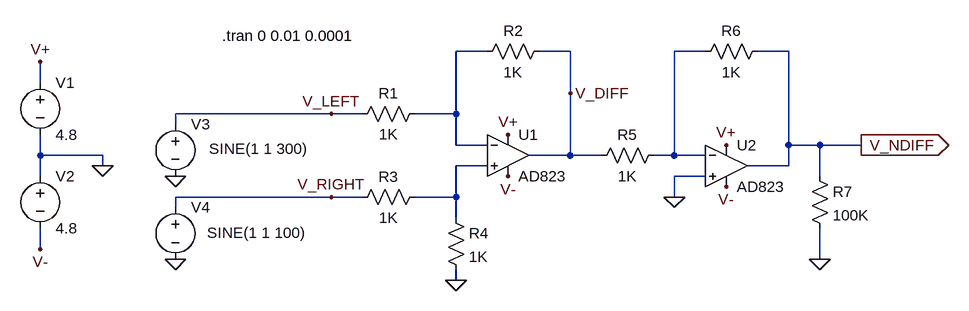
[diagram p0: schematic subtracter.asc]
subtracter.asc, the LTspice schematic file:
Version 4
SHEET 1 880 680
WIRE 16 96 -32 96
WIRE 144 96 96 96
WIRE 352 96 304 96
WIRE 480 96 432 96
WIRE -672 144 -672 112
WIRE 144 160 144 96
WIRE -224 192 -464 192
WIRE -176 192 -224 192
WIRE -32 192 -32 96
WIRE -32 192 -96 192
WIRE -464 208 -464 192
WIRE -32 240 -32 192
WIRE 16 240 -32 240
WIRE 480 240 480 96
WIRE 528 240 480 240
WIRE 592 240 528 240
WIRE -672 256 -672 224
WIRE -576 256 -672 256
WIRE 144 256 144 160
WIRE 144 256 80 256
WIRE 192 256 144 256
WIRE 304 256 304 96
WIRE 304 256 272 256
WIRE 352 256 304 256
WIRE -576 272 -576 256
WIRE 16 272 -32 272
WIRE 480 272 480 240
WIRE 480 272 416 272
WIRE -672 288 -672 256
WIRE 352 288 304 288
WIRE 528 288 528 240
WIRE -224 320 -464 320
WIRE -176 320 -224 320
WIRE -32 320 -32 272
WIRE -32 320 -96 320
WIRE 304 320 304 288
WIRE -464 336 -464 320
WIRE -32 352 -32 320
WIRE -672 400 -672 368
WIRE 528 416 528 368
WIRE -32 448 -32 432
FLAG -576 272 0
FLAG -672 112 V+
FLAG 48 224 V+
FLAG -672 400 V-
FLAG 48 288 V-
FLAG 592 240 V_NDIFF
IOPIN 592 240 Out
FLAG -32 448 0
FLAG 384 240 V+
FLAG 384 304 V-
FLAG -464 288 0
FLAG -464 416 0
FLAG 304 320 0
FLAG 528 416 0
FLAG -224 192 V_LEFT
FLAG -224 320 V_RIGHT
FLAG 144 160 V_DIFF
SYMBOL res -80 176 R90
WINDOW 0 0 56 VBottom 2
WINDOW 3 32 56 VTop 2
SYMATTR InstName R1
SYMATTR Value 1K
SYMATTR SpiceLine tol=1 pwr=0.1
SYMBOL res 112 80 R90
WINDOW 0 0 56 VBottom 2
WINDOW 3 32 56 VTop 2
SYMATTR InstName R2
SYMATTR Value 1K
SYMBOL res -80 304 R90
WINDOW 0 0 56 VBottom 2
WINDOW 3 32 56 VTop 2
SYMATTR InstName R3
SYMATTR Value 1K
SYMBOL voltage -672 128 R0
WINDOW 123 0 0 Left 0
WINDOW 39 0 0 Left 0
SYMATTR InstName V1
SYMATTR Value 4.8
SYMBOL voltage -672 272 R0
WINDOW 123 0 0 Left 0
WINDOW 39 0 0 Left 0
SYMATTR InstName V2
SYMATTR Value 4.8
SYMBOL Opamps\\AD823 48 192 R0
SYMATTR InstName U1
SYMBOL res -48 336 R0
SYMATTR InstName R4
SYMATTR Value 1K
SYMBOL Opamps\\AD823 384 208 R0
SYMATTR InstName U2
SYMBOL res 288 240 R90
WINDOW 0 0 56 VBottom 2
WINDOW 3 32 56 VTop 2
SYMATTR InstName R5
SYMATTR Value 1K
SYMBOL res 448 80 R90
WINDOW 0 0 56 VBottom 2
WINDOW 3 32 56 VTop 2
SYMATTR InstName R6
SYMATTR Value 1K
SYMBOL voltage -464 192 R0
WINDOW 123 0 0 Left 0
WINDOW 39 0 0 Left 0
WINDOW 3 52 54 Left 2
SYMATTR InstName V3
SYMATTR Value SINE(1 1 300)
SYMBOL voltage -464 320 R0
WINDOW 123 0 0 Left 0
WINDOW 39 0 0 Left 0
WINDOW 3 49 55 Left 2
SYMATTR InstName V4
SYMATTR Value SINE(1 1 100)
SYMBOL res 512 272 R0
SYMATTR InstName R7
SYMATTR Value 100K
TEXT -392 72 Left 2 !.tran 0 0.01 0.0001

The netlist it stands for:
* subtracter.asc
R1 N001 V_LEFT 1K tol=1 pwr=0.1
R2 V_DIFF N001 1K
R3 N003 V_RIGHT 1K
V1 V+ 0 4.8
V2 0 V- 4.8
XU1 N003 N001 V+ V- V_DIFF AD823  ; pins In+ In- V+ V- OUT
R4 N003 0 1K
XU2 0 N002 V+ V- V_NDIFF AD823  ; pins In+ In- V+ V- OUT
R5 N002 V_DIFF 1K
R6 V_NDIFF N002 1K
V3 V_LEFT 0 SINE(1 1 300)
V4 V_RIGHT 0 SINE(1 1 100)
R7 V_NDIFF 0 100K
.tran 0 0.01 0.0001
.lib ADI.lib
.backanno
.end